# EAGLE design ina125 (EAGLE 9.5.2)
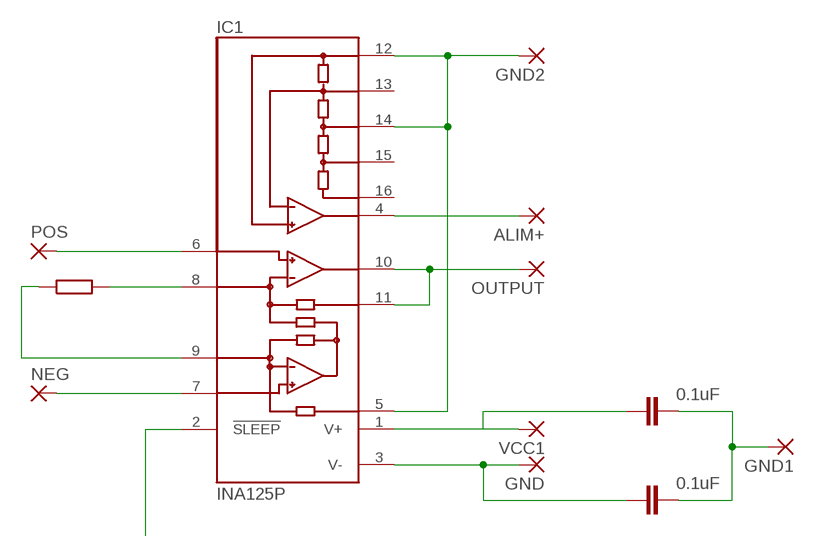
[diagram p0: schematic, sheet 1]

## Parts
ALIM+  1,6/0,8  [1,6/0,8]
C1  0.1uF  C2,5-3  [C2.5-3]
C2  0.1uF  C2,5-3  [C2.5-3]
GND  1,6/0,8  [1,6/0,8]
GND1  1,6/0,8  [1,6/0,8]
GND2  1,6/0,8  [1,6/0,8]
IC1  INA125P  [DIL16]
NEG  1,6/0,8  [1,6/0,8]
OUTPUT  1,6/0,8  [1,6/0,8]
POS  1,6/0,8  [1,6/0,8]
VCC1  1,6/0,8  [1,6/0,8]

## Nets
N$1: IC1.8(RG)
N$2: IC1.9(RG)
N$3: C2.1 GND.1(P) IC1.3(V-)
N$4: C1.2 C2.2 GND1.1(P)
N$5: C1.1 IC1.1(V+) VCC1.1(P)
N$6: IC1.10(OUT) IC1.11(SENSE) OUTPUT.1(P)
N$7: IC1.2(!SLEEP)
N$8: IC1.6(+IN) POS.1(P)
N$9: IC1.7(-IN) NEG.1(P)
N$10: ALIM+.1(P) IC1.4(REFOUT)
N$11: GND2.1(P) IC1.5(REF) IC1.12(REFCOM) IC1.14(REF2.5)
Unconnected: IC1.13(REFBG) IC1.15(REF5) IC1.16(REF10)

## Library data of the parts
ALIM+ GND GND1 GND2 NEG OUTPUT POS VCC1 = wirepad:1,6/0,8: THROUGH-HOLE PAD
C1 C2 = capacitor-wima:C: CAPACITOR naming: grid - package width
IC1 = ina125:INA125: Instrumentation Amplifier with Precision Voltage Reference

## Board
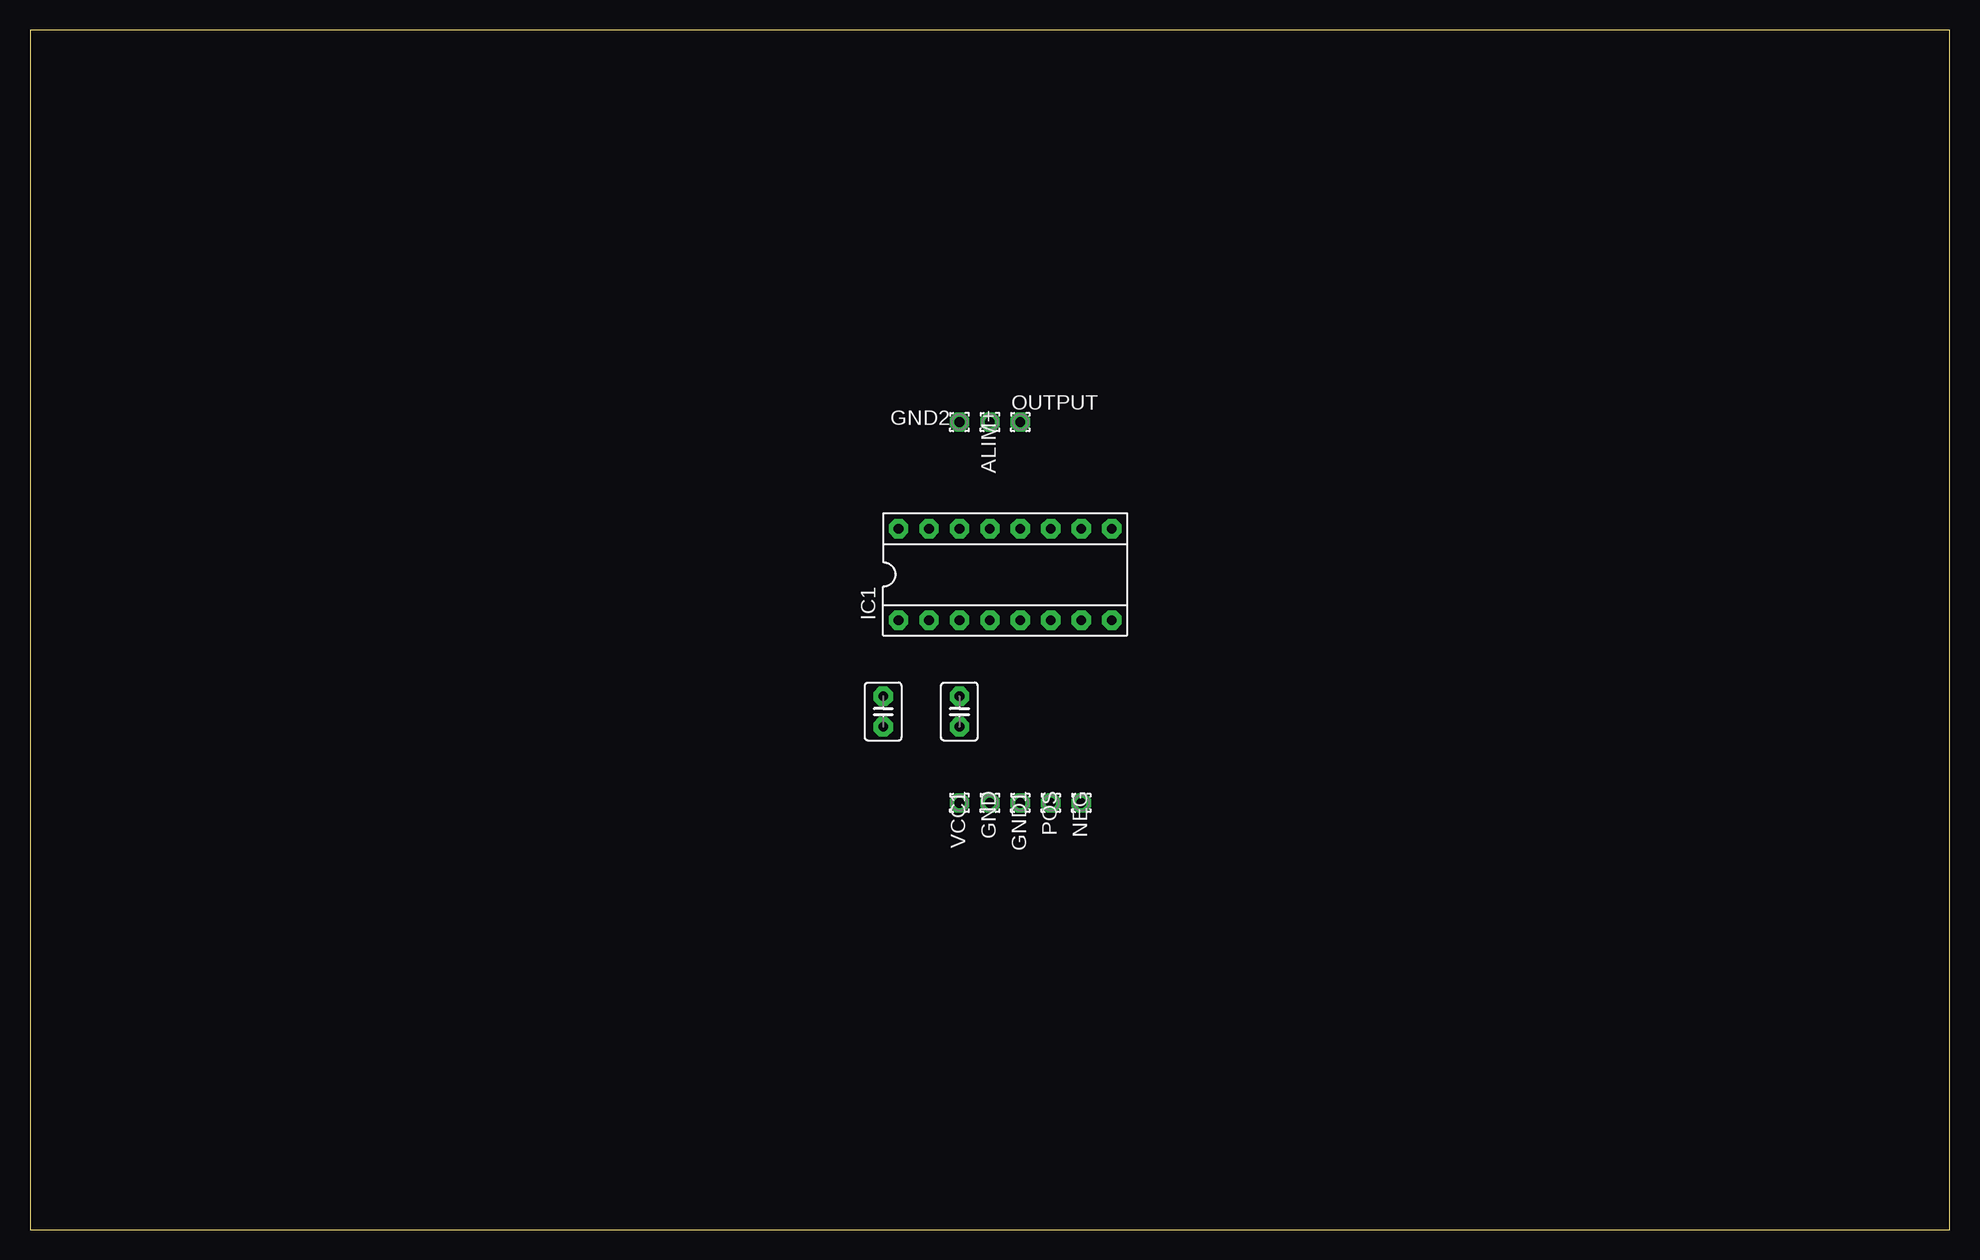
[diagram p1: board, top side]
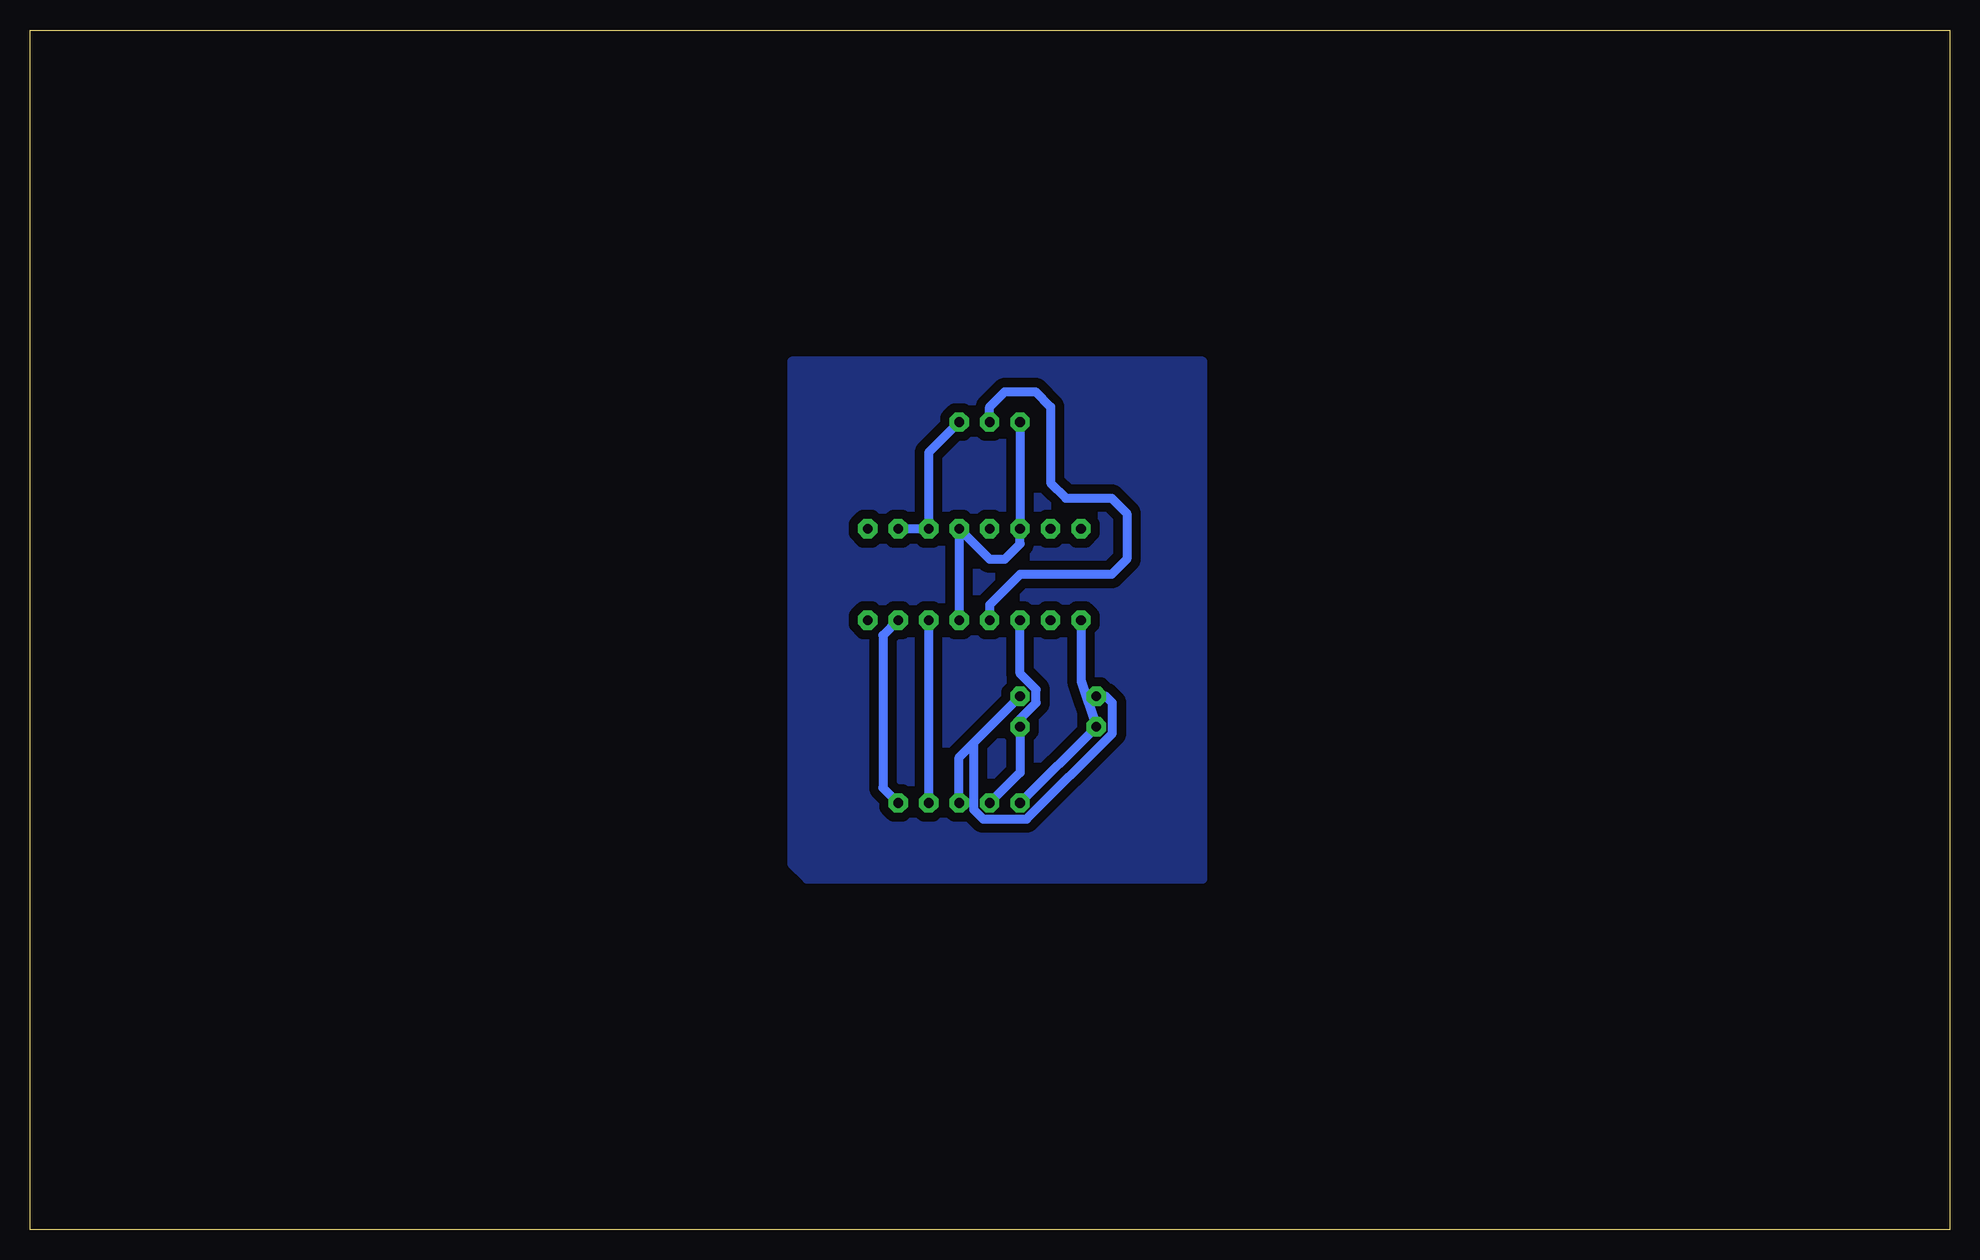
[diagram p2: board, bottom side, seen from below]

Size 160 x 100 mm. Coordinates in mm from the lower left corner, seen from the top.
Outline: 0,0 160,0 160,100 0,100 0,0
Copper layers (1*16): Top 0.035mm / dielectric 0.15mm / Bottom 0.035mm
Design rules "default": minimum track width 6mil, minimum drill 0.35mm, track to track 6mil, track to pad 6mil, pad to pad 6mil, via to via 6mil, smd to smd 6mil, copper to edge 40mil, drill to drill 6mil, minimum pad ring 10mil, minimum via ring 8mil, stop-mask expansion 4mil, vias tented up to drill 0mil, thermal gap 10mil

### Footprints (pad centres in the part's own frame; a part is rotated, then mirrored left to right if it is on the bottom)
1,6/0,8 = drill 0.813 pad 1.6 octagon: 1 0,0
C2.5-3 = drill 0.813 pad 1.6 octagon: 1 -1.27,0; 2 1.27,0
DIL16 = drill 0.813 pad 1.6 octagon: 1 -8.89,-3.81; 2 -6.35,-3.81; 3 -3.81,-3.81; 4 -1.27,-3.81; 5 1.27,-3.81; 6 3.81,-3.81; 7 6.35,-3.81; 8 8.89,-3.81; 9 8.89,3.81; 10 6.35,3.81; 11 3.81,3.81; 12 1.27,3.81; 13 -1.27,3.81; 14 -3.81,3.81; 15 -6.35,3.81; 16 -8.89,3.81

### Placement (x,y rotation side)
ALIM+  80.01,67.31 0 top
C1  71.12,43.18 90 top
C2  77.47,43.18 90 top
GND  80.01,35.56 0 top
GND1  82.55,35.56 0 top
GND2  77.47,67.31 0 top
IC1  81.28,54.61 0 top
NEG  87.63,35.56 0 top
OUTPUT  82.55,67.31 0 top
POS  85.09,35.56 0 top
VCC1  77.47,35.56 0 top

### Tracks (layer width: path | path; a pad name or v marks a point on that pad's centre or on a via)
GND
  pour Bottom (isolate 0.762): 64.77,72.39 96.52,72.39 96.52,30.48 95.25,29.21 62.23,29.21 62.23,72.39
N$3
  Bottom 0.762: IC1.3 77.47,46.34 76.14,45 76.14,43.9 77.47,42.56 C2.1 77.47,38.1 GND.1
N$4
  Bottom 0.762: GND1.1 82.55,39.37 C2.2 81.34,40.58 81.34,35.01 80.56,34.23 76.92,34.23 69.79,41.36 69.79,43.92 70.32,44.45 C1.2
N$5
  Bottom 0.762: IC1.1 72.39,45.72 C1.1 VCC1.1
N$6
  Bottom 0.762: OUTPUT.1 85.09,64.77 IC1.11 IC1.10
N$8
  Bottom 0.762: IC1.6 POS.1
N$9
  Bottom 0.762: IC1.7 88.9,49.53 88.9,36.83 NEG.1
N$10
  Bottom 0.762: ALIM+.1 80.01,68.58 78.74,69.85 76.2,69.85 74.93,68.58 74.93,62.23 73.66,60.96 69.85,60.96 68.58,59.69 68.58,55.88 69.85,54.61 77.47,54.61 80.01,52.07 IC1.4
N$11
  Bottom 0.762: IC1.5 IC1.12 80.01,55.88 78.74,55.88 77.47,57.15 IC1.14 GND2.1